# EAGLE design digipots (EAGLE 9.6.2)
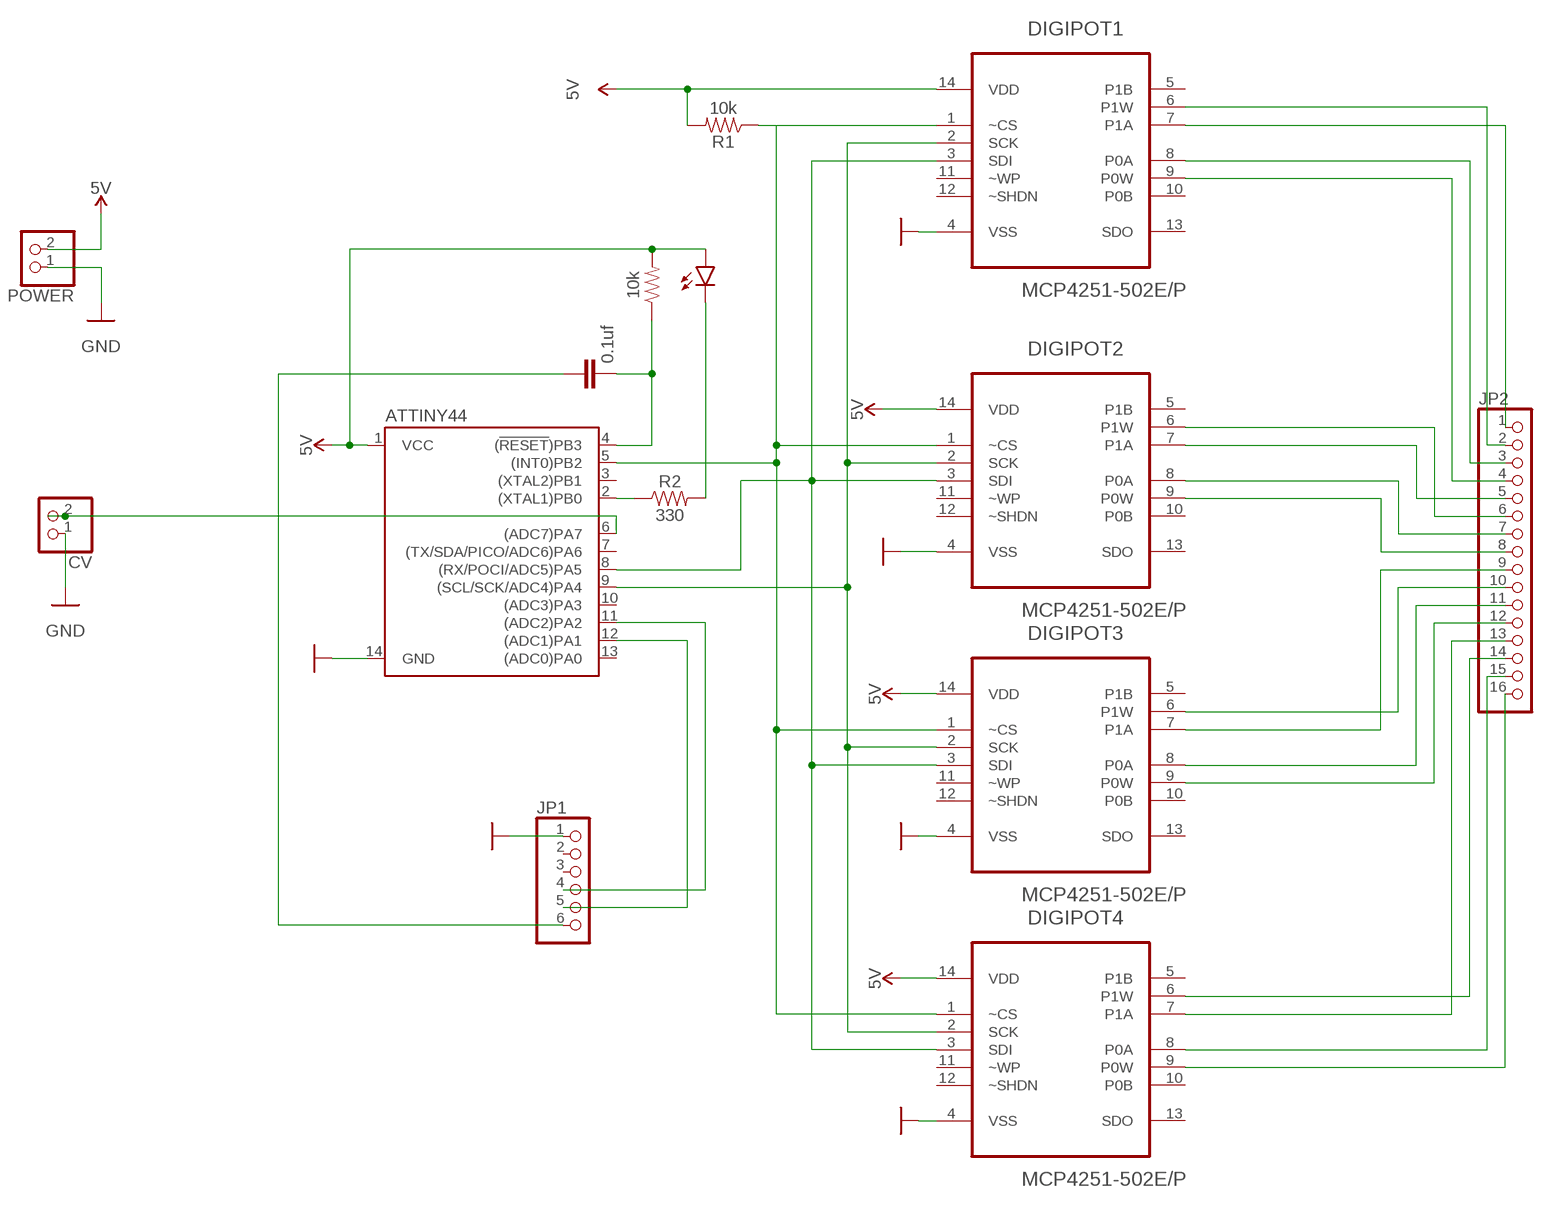
[diagram p0: schematic, sheet 1]

## Parts
ATTINY44  ATTINY84ATTINY84-20PU  [DIP14]
C2  0.1uf  C-EU025-024X044  [C025-024X044]
CV  PINHD-1X2  [1X02]
D1  LED-5MM-KIT-NO-SILK  [LED_5MM-KIT-NO-SILK]
DIGIPOT1  MCP4251-502E/P  [DIP254P762X533-14]
DIGIPOT2  MCP4251-502E/P  [DIP254P762X533-14]
DIGIPOT3  MCP4251-502E/P  [DIP254P762X533-14]
DIGIPOT4  MCP4251-502E/P  [DIP254P762X533-14]
JP1  PINHD-1X6  [1X06]
JP2  PINHD-1X16  [1X16]
POWER  PINHD-1X2  [1X02]
R1  10k  1KOHM-HORIZ-1/4W-5%  [AXIAL-0.3]
R2  330  1KOHM-HORIZ-1/4W-5%  [AXIAL-0.3]
R3  10k  1KOHM-HORIZ-1/4W-5%  [AXIAL-0.3]

## Nets
5V: ATTINY44.1(VCC) D1.A DIGIPOT1.14(VDD) DIGIPOT2.14(VDD) DIGIPOT3.14(VDD) DIGIPOT4.14(VDD) POWER.2 R1.P$2 R3.P$2
GND: ATTINY44.14(GND) CV.1 DIGIPOT1.4(VSS) DIGIPOT2.4(VSS) DIGIPOT3.4(VSS) DIGIPOT4.4(VSS) JP1.1 POWER.1
N$1: DIGIPOT4.9(P0W) JP2.16
N$2: DIGIPOT4.8(P0A) JP2.15
N$3: DIGIPOT4.6(P1W) JP2.14
N$4: DIGIPOT4.7(P1A) JP2.13
N$5: DIGIPOT3.9(P0W) JP2.12
N$6: DIGIPOT3.8(P0A) JP2.11
N$7: DIGIPOT3.6(P1W) JP2.10
N$8: DIGIPOT3.7(P1A) JP2.9
N$9: DIGIPOT2.9(P0W) JP2.8
N$10: DIGIPOT2.8(P0A) JP2.7
N$11: DIGIPOT2.7(P1A) JP2.5
N$12: DIGIPOT2.6(P1W) JP2.6
N$13: DIGIPOT1.9(P0W) JP2.4
N$14: DIGIPOT1.8(P0A) JP2.3
N$15: DIGIPOT1.7(P1A) JP2.1
N$16: DIGIPOT1.6(P1W) JP2.2
N$17: ATTINY44.5((INT0)PB2) DIGIPOT1.1(~CS) DIGIPOT2.1(~CS) DIGIPOT3.1(~CS) DIGIPOT4.1(~CS) R1.P$1
N$18: ATTINY44.9((SCL/SCK/ADC4)PA4) DIGIPOT1.2(SCK) DIGIPOT2.2(SCK) DIGIPOT3.2(SCK) DIGIPOT4.2(SCK)
N$19: ATTINY44.2((XTAL1)PB0) R2.P$1
N$20: ATTINY44.8((RX/POCI/ADC5)PA5) DIGIPOT1.3(SDI) DIGIPOT2.3(SDI) DIGIPOT3.3(SDI) DIGIPOT4.3(SDI)
N$21: D1.K(C) R2.P$2
N$22: ATTINY44.4((!RESET!)PB3) C2.2 R3.P$1
N$23: ATTINY44.12((ADC1)PA1) JP1.5
N$24: C2.1 JP1.6
N$25: ATTINY44.11((ADC2)PA2) JP1.4
N$26: ATTINY44.6((ADC7)PA7) CV.2
Unconnected: ATTINY44.3((XTAL2)PB1) ATTINY44.7((TX/SDA/PICO/ADC6)PA6) ATTINY44.10((ADC3)PA3) ATTINY44.13((ADC0)PA0) DIGIPOT1.5(P1B) DIGIPOT1.10(P0B) DIGIPOT1.11(~WP) DIGIPOT1.12(~SHDN) DIGIPOT1.13(SDO) DIGIPOT2.5(P1B) DIGIPOT2.10(P0B) DIGIPOT2.11(~WP) DIGIPOT2.12(~SHDN) DIGIPOT2.13(SDO) DIGIPOT3.5(P1B) DIGIPOT3.10(P0B) DIGIPOT3.11(~WP) DIGIPOT3.12(~SHDN) DIGIPOT3.13(SDO) DIGIPOT4.5(P1B) DIGIPOT4.10(P0B) DIGIPOT4.11(~WP) DIGIPOT4.12(~SHDN) DIGIPOT4.13(SDO) JP1.2 JP1.3

## Library data of the parts
ATTINY44 = SparkFun-IC-Microcontroller:ATTINY84: Atmel 14-pin 2/4/8kB flash uC Datasheet <https://cdn.sparkfun.com/datasheets/Widgets/doc8006.pdf> SparkFun Products Tiny AVR Programmer <https://www.sparkfun.com/products/11801> (PGM-11801) SparkFun Servo Trigger - Continuous Rotation <https://www.sparkfun.com/products/13872> (WIG-13872) SparkFun Servo Trigger <https://www.sparkfun.com/products/13118> (WIG-13118)
C2 = rcl:C-EU: CAPACITOR, European symbol; SPICEPREFIX: C
CV POWER = pinhead:PINHD-1X2: PIN HEADER
D1 = SparkFun-LED:LED: LED (Generic) Standard schematic elements and footprints for 5mm, 3mm, 1206, and 0603 sized LEDs. Generic LEDs with no color specified.
DIGIPOT1-DIGIPOT4 = MCP4251-502E_P:MCP4251-502E/P: Digital POT Check availability <https://pricing.snapeda.com/parts/MCP4251-502E/P/Microchip/view-part?ref=eda>; AVAILABILITY: In Stock; DESCRIPTION: Digital Potentiometer 5k Ohm 2 Circuit 257 Taps SPI Interface 14-PDIP; MF: Microchip; MP: MCP4251-502E/P; PACKAGE: PDIP-14 Atmel; PRICE: None; PURCHASE-URL: https://pricing.snapeda.com/search/part/MCP4251-502E/P/?ref=eda
JP1 = adafruit:PINHD-1X6: PIN HEADER
JP2 = pinhead:PINHD-1X16: PIN HEADER
R1-R3 = SparkFun-Resistors:1KOHM: 1kΩ resistor A resistor is a passive two-terminal electrical component that implements electrical resistance as a circuit element. Resistors act to reduce current flow, and, at the same time, act to lower voltage levels within circuits. - Wikipedia; PROD_ID: RES-08380; VALUE: 1k

## Board
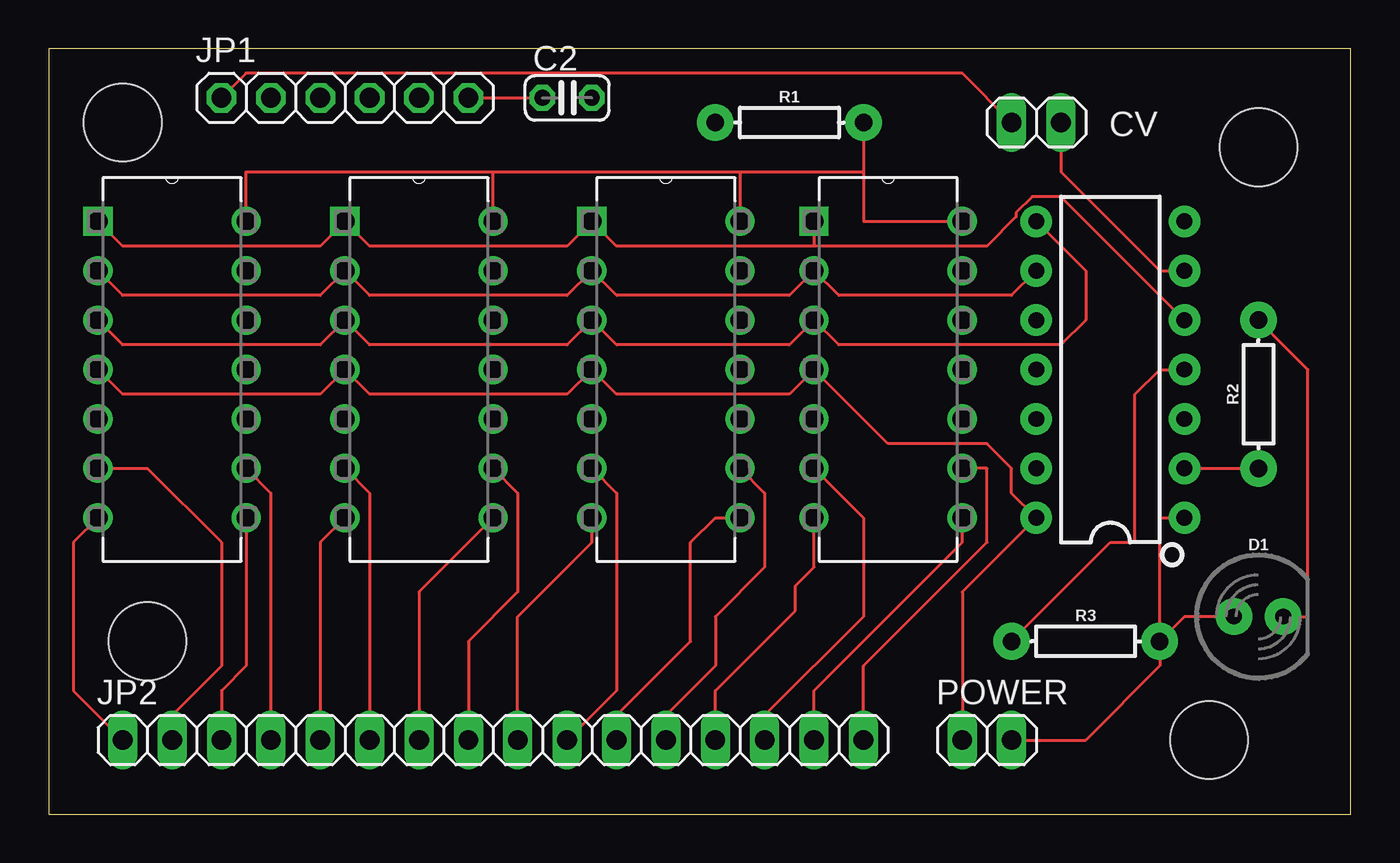
[diagram p1: board, top side]
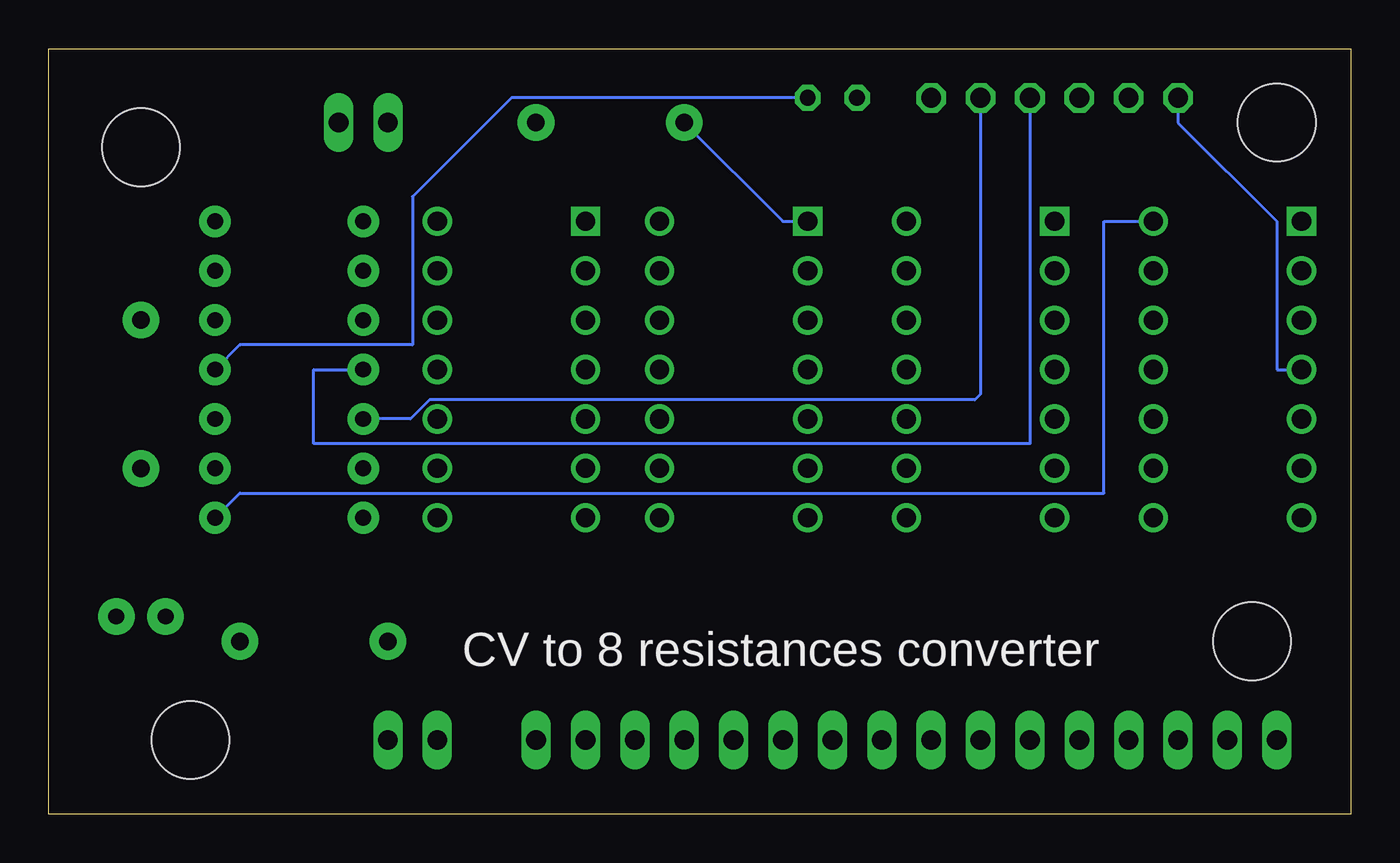
[diagram p2: board, bottom side, seen from below]

Size 66.98 x 39.36 mm. Coordinates in mm from the lower left corner, seen from the top.
Outline: 0,0 66.98,0 66.98,39.36 0,39.36 0,0
Copper layers (1*16): Top 0.035mm / dielectric 1.5mm / Bottom 0.035mm
Design rules "default": minimum track width 6mil, minimum drill 0.35mm, track to track 6mil, track to pad 6mil, pad to pad 6mil, via to via 6mil, smd to smd 6mil, copper to edge 40mil, drill to drill 6mil, minimum pad ring 10mil, minimum via ring 8mil, stop-mask expansion 4mil, vias tented up to drill 0mil, thermal gap 10mil
Holes 4 mm at 59.69,3.81 3.81,35.56 62.23,34.29 5.08,8.89

### Footprints (pad centres in the part's own frame; a part is rotated, then mirrored left to right if it is on the bottom)
DIP14 = drill 0.813 pad 1.626: 1 -7.62,-3.81; 2 -5.08,-3.81; 3 -2.54,-3.81; 4 0,-3.81; 5 2.54,-3.81; 6 5.08,-3.81; 7 7.62,-3.81; 8 7.62,3.81; 9 5.08,3.81; 10 2.54,3.81; 11 0,3.81; 12 -2.54,3.81; 13 -5.08,3.81; 14 -7.62,3.81
C025-024X044 = drill 0.813 octagon: 1 -1.27,0; 2 1.27,0
1X02 = drill 1.016 long: 1 -1.27,0; 2 1.27,0
LED_5MM-KIT-NO-SILK = drill 0.813 pad 1.88: A -1.27,0; K 1.27,0
DIP254P762X533-14 = drill 0.991 square: 1 -7.62,15.24 | drill 0.991: 2 -7.62,12.7; 3 -7.62,10.16; 4 -7.62,7.62; 5 -7.62,5.08; 6 -7.62,2.54; 7 -7.62,0; 8 0,0; 9 0,2.54; 10 0,5.08; 11 0,7.62; 12 0,10.16; 13 0,12.7; 14 0,15.24
1X06 = drill 1.016 octagon: 1 -6.35,0; 2 -3.81,0; 3 -1.27,0; 4 1.27,0; 5 3.81,0; 6 6.35,0
1X16 = drill 1.016 long: 1 -19.05,0; 2 -16.51,0; 3 -13.97,0; 4 -11.43,0; 5 -8.89,0; 6 -6.35,0; 7 -3.81,0; 8 -1.27,0; 9 1.27,0; 10 3.81,0; 11 6.35,0; 12 8.89,0; 13 11.43,0; 14 13.97,0; 15 16.51,0; 16 19.05,0
AXIAL-0.3 = drill 0.9 pad 1.88: P$1 -3.81,0; P$2 3.81,0

### Placement (x,y rotation side)
ATTINY44  54.61,22.86 90 top
C2  26.67,36.83 0 top
CV  50.8,35.56 0 top
D1  62.23,10.16 0 top
DIGIPOT1  10.16,15.24 0 top
DIGIPOT2  22.86,15.24 0 top
DIGIPOT3  35.56,15.24 0 top
DIGIPOT4  46.99,15.24 0 top
JP1  15.24,36.83 0 top
JP2  22.86,3.81 0 top
POWER  48.26,3.81 0 top
R1  38.1,35.56 0 top
R2  62.23,21.59 90 top
R3  53.34,8.89 0 top

### Tracks (layer width: path | path; a pad name or v marks a point on that pad's centre or on a via)
5V
  Top 0.152: POWER.2 53.34,3.81 57.15,7.62 R3.P$2 | R3.P$2 57.15,15.24 ATTINY44.1 | DIGIPOT1.14 10.16,33.02 22.86,33.02 | 22.86,33.02 35.56,33.02 | 35.56,33.02 41.91,33.02 | 35.56,33.02 DIGIPOT3.14 | R1.P$2 41.91,33.02 | 41.91,33.02 41.91,30.48 DIGIPOT4.14 | D1.A 58.42,10.16 R3.P$2 | DIGIPOT2.14 22.86,33.02
  Bottom 0.152: ATTINY44.1 57.15,16.51 12.7,16.51 12.7,30.48 DIGIPOT1.14
GND
  Top 0.152: DIGIPOT1.4 3.81,21.59 13.97,21.59 DIGIPOT2.4 16.51,21.59 26.67,21.59 DIGIPOT3.4 29.21,21.59 38.1,21.59 DIGIPOT4.4 43.18,19.05 48.26,19.05 49.53,17.78 49.53,16.51 ATTINY44.14 46.99,11.43 POWER.1 46.99,2.54 | CV.1 46.99,38.1 10.16,38.1 JP1.1
  Bottom 0.152: JP1.1 8.89,35.56 3.81,30.48 3.81,22.86 DIGIPOT1.4
N$1
  Top 0.152: JP2.16 41.91,7.62 48.26,13.97 48.26,17.78 DIGIPOT4.9
N$2
  Top 0.152: JP2.15 39.37,6.35 46.99,13.97 DIGIPOT4.8
N$3
  Top 0.152: DIGIPOT4.6 41.91,15.24 41.91,10.16 36.83,5.08 JP2.14
N$4
  Top 0.152: JP2.13 34.29,6.35 38.41,10.46 38.41,11.73 39.37,12.7 DIGIPOT4.7
N$5
  Top 0.152: DIGIPOT3.9 36.83,16.51 36.83,12.7 34.29,10.16 34.29,7.62 31.75,5.08 JP2.12
N$6
  Top 0.152: JP2.11 29.21,5.08 33.02,8.89 33.02,13.97 34.29,15.24 DIGIPOT3.8
N$7
  Top 0.152: DIGIPOT3.6 29.21,16.51 29.21,6.35 JP2.10
N$8
  Top 0.152: JP2.9 24.13,10.16 27.94,13.97 DIGIPOT3.7
N$9
  Top 0.152: DIGIPOT2.9 24.13,16.51 24.13,11.43 21.59,8.89 JP2.8
N$10
  Top 0.152: DIGIPOT2.8 19.05,11.43 JP2.7
N$11
  Top 0.152: DIGIPOT2.7 13.97,13.97 JP2.5
N$12
  Top 0.152: DIGIPOT2.6 16.51,16.51 JP2.6
N$13
  Top 0.152: DIGIPOT1.9 11.43,16.51 JP2.4
N$14
  Top 0.152: DIGIPOT1.8 10.16,7.62 8.89,6.35 JP2.3
N$15
  Top 0.152: DIGIPOT1.7 1.27,13.97 1.27,6.35 JP2.1
N$16
  Top 0.152: DIGIPOT1.6 5.08,17.78 8.89,13.97 8.89,7.62 6.35,5.08 JP2.2
N$17
  Top 0.152: DIGIPOT1.1 3.81,29.21 13.97,29.21 DIGIPOT2.1 16.51,29.21 26.67,29.21 DIGIPOT3.1 29.21,29.21 39.37,29.21 | ATTINY44.5 52.07,31.75 50.6,31.75 49.76,30.91 49.76,30.71 48.26,29.21 39.37,29.21 | DIGIPOT4.1 39.37,29.21
  Bottom 0.152: R1.P$1 29.21,30.48 DIGIPOT3.1
N$18
  Top 0.152: DIGIPOT1.2 3.81,26.67 13.97,26.67 DIGIPOT2.2 16.51,26.67 26.67,26.67 DIGIPOT3.2 29.21,26.67 38.1,26.67 DIGIPOT4.2 40.64,26.67 49.53,26.67 ATTINY44.9
N$19
  Top 0.152: ATTINY44.2 R2.P$1
N$20
  Top 0.152: DIGIPOT1.3 3.81,24.13 13.97,24.13 DIGIPOT2.3 16.51,24.13 26.67,24.13 DIGIPOT3.3 29.21,24.13 38.1,24.13 DIGIPOT4.3 40.64,24.13 52.07,24.13 53.34,25.4 53.34,27.94 ATTINY44.8
N$21
  Top 0.152: D1.K 64.77,10.16 64.77,22.86 R2.P$2
N$22
  Top 0.152: R3.P$1 54.61,13.97 55.88,13.97 55.88,21.59 57.15,22.86 ATTINY44.4
  Bottom 0.152: C2.2 43.18,36.83 48.26,31.75 48.26,24.13 57.15,24.13 ATTINY44.4
N$23
  Bottom 0.152: JP1.5 19.05,21.59 19.34,21.3 47.4,21.3 48.37,20.32 ATTINY44.12
N$24
  Top 0.152: JP1.6 C2.1
N$25
  Bottom 0.152: JP1.4 16.51,19.05 53.34,19.05 53.34,22.86 ATTINY44.11
N$26
  Top 0.152: CV.2 52.07,33.02 57.15,27.94 ATTINY44.6

### Text on the board
bPlace: CV to 8 resistances converter